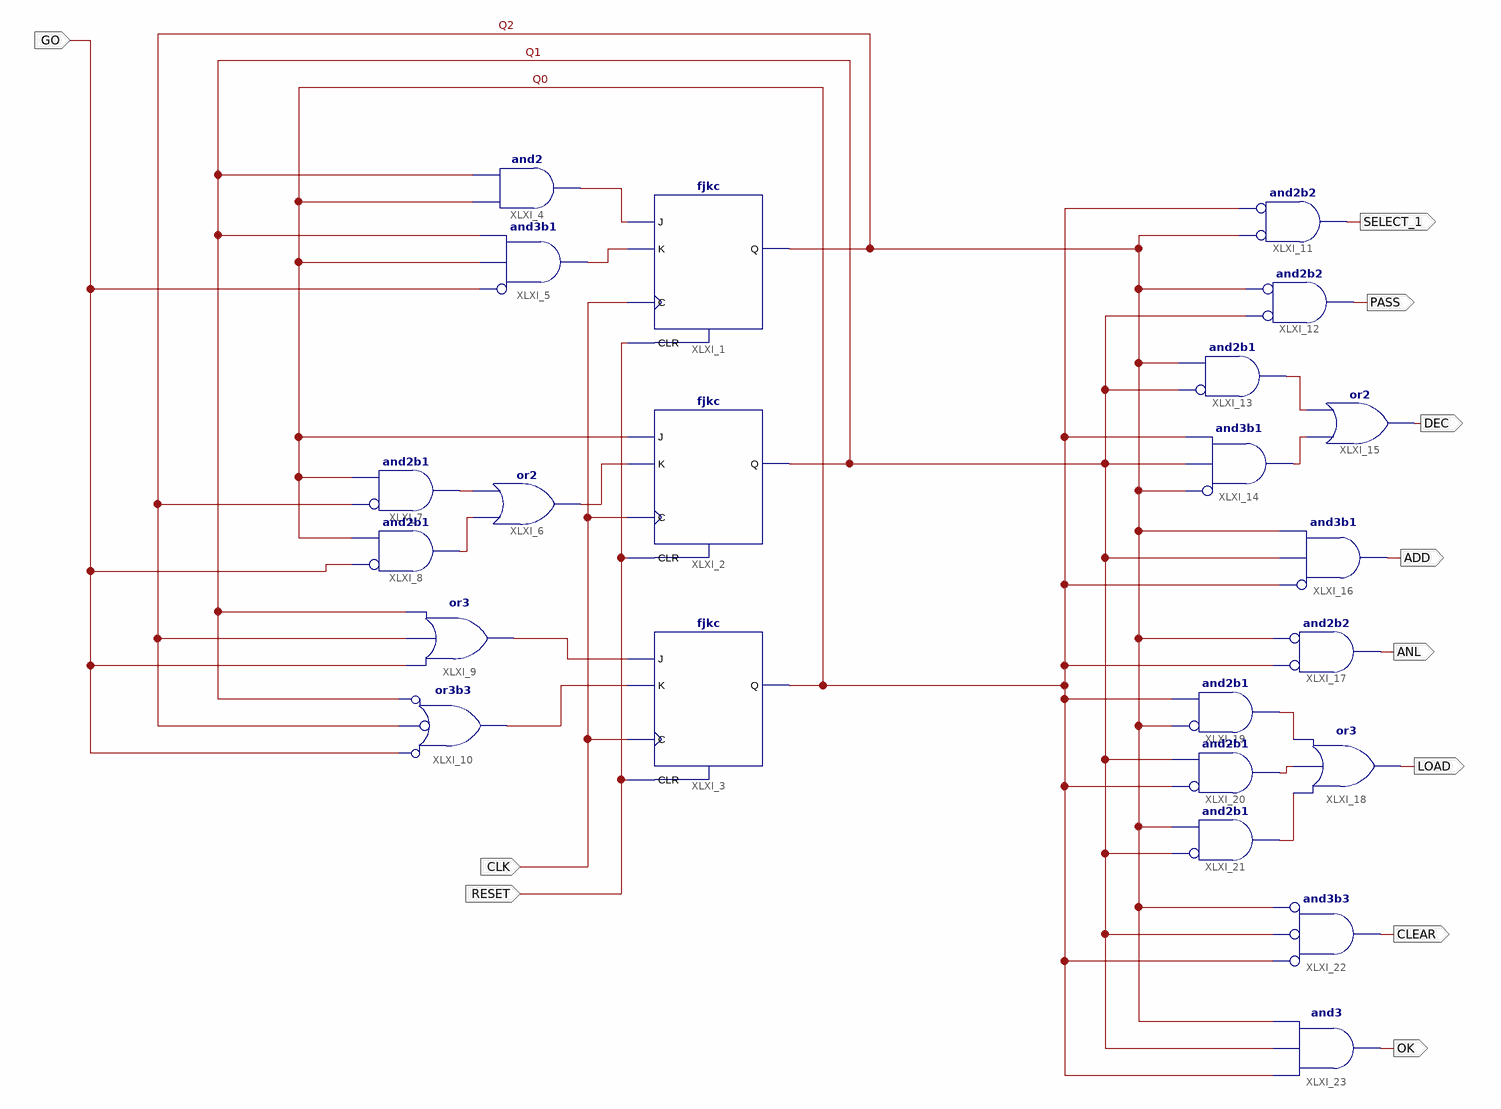
[diagram p0: schematic sheet 1]
// Xilinx ISE schematic EsquematicoProjetoAvaliacaoSL2.sch (spartan3e) as structural Verilog: 23 symbols, 11 ports
module EsquematicoProjetoAvaliacaoSL2 (
  input  GO,
  input  RESET,
  input  CLK,
  output SELECT_1,
  output PASS,
  output DEC,
  output ADD,
  output ANL,
  output LOAD,
  output CLEAR,
  output OK
);

  wire Q0, Q1, Q2, XLXN_4, XLXN_6, XLXN_8, XLXN_9, XLXN_10, XLXN_18, XLXN_22, XLXN_29, XLXN_30, XLXN_33,
       XLXN_34, XLXN_35;

  fjkc XLXI_1 (.C(CLK), .CLR(RESET), .J(XLXN_4), .K(XLXN_6), .Q(Q2));
  fjkc XLXI_2 (.C(CLK), .CLR(RESET), .J(Q0), .K(XLXN_8), .Q(Q1));
  fjkc XLXI_3 (.C(CLK), .CLR(RESET), .J(XLXN_18), .K(XLXN_22), .Q(Q0));
  and XLXI_4 (XLXN_4, Q0, Q1);
  and XLXI_5 (XLXN_6, ~GO, Q0, Q1);  // and3b1
  or XLXI_6 (XLXN_8, XLXN_10, XLXN_9);
  and XLXI_7 (XLXN_9, ~Q2, Q0);  // and2b1
  and XLXI_8 (XLXN_10, ~GO, Q0);  // and2b1
  or XLXI_9 (XLXN_18, GO, Q2, Q1);
  or XLXI_10 (XLXN_22, ~GO, ~Q2, ~Q1);  // or3b3
  and XLXI_11 (SELECT_1, ~Q2, ~Q0);  // and2b2
  and XLXI_12 (PASS, ~Q1, ~Q2);  // and2b2
  and XLXI_13 (XLXN_29, ~Q1, Q2);  // and2b1
  and XLXI_14 (XLXN_30, ~Q2, Q1, Q0);  // and3b1
  or XLXI_15 (DEC, XLXN_30, XLXN_29);
  and XLXI_16 (ADD, ~Q0, Q1, Q2);  // and3b1
  and XLXI_17 (ANL, ~Q0, ~Q2);  // and2b2
  or XLXI_18 (LOAD, XLXN_35, XLXN_34, XLXN_33);
  and XLXI_19 (XLXN_33, ~Q2, Q0);  // and2b1
  and XLXI_20 (XLXN_34, ~Q0, Q1);  // and2b1
  and XLXI_21 (XLXN_35, ~Q1, Q2);  // and2b1
  and XLXI_22 (CLEAR, ~Q0, ~Q1, ~Q2);  // and3b3
  and XLXI_23 (OK, Q0, Q1, Q2);
endmodule
